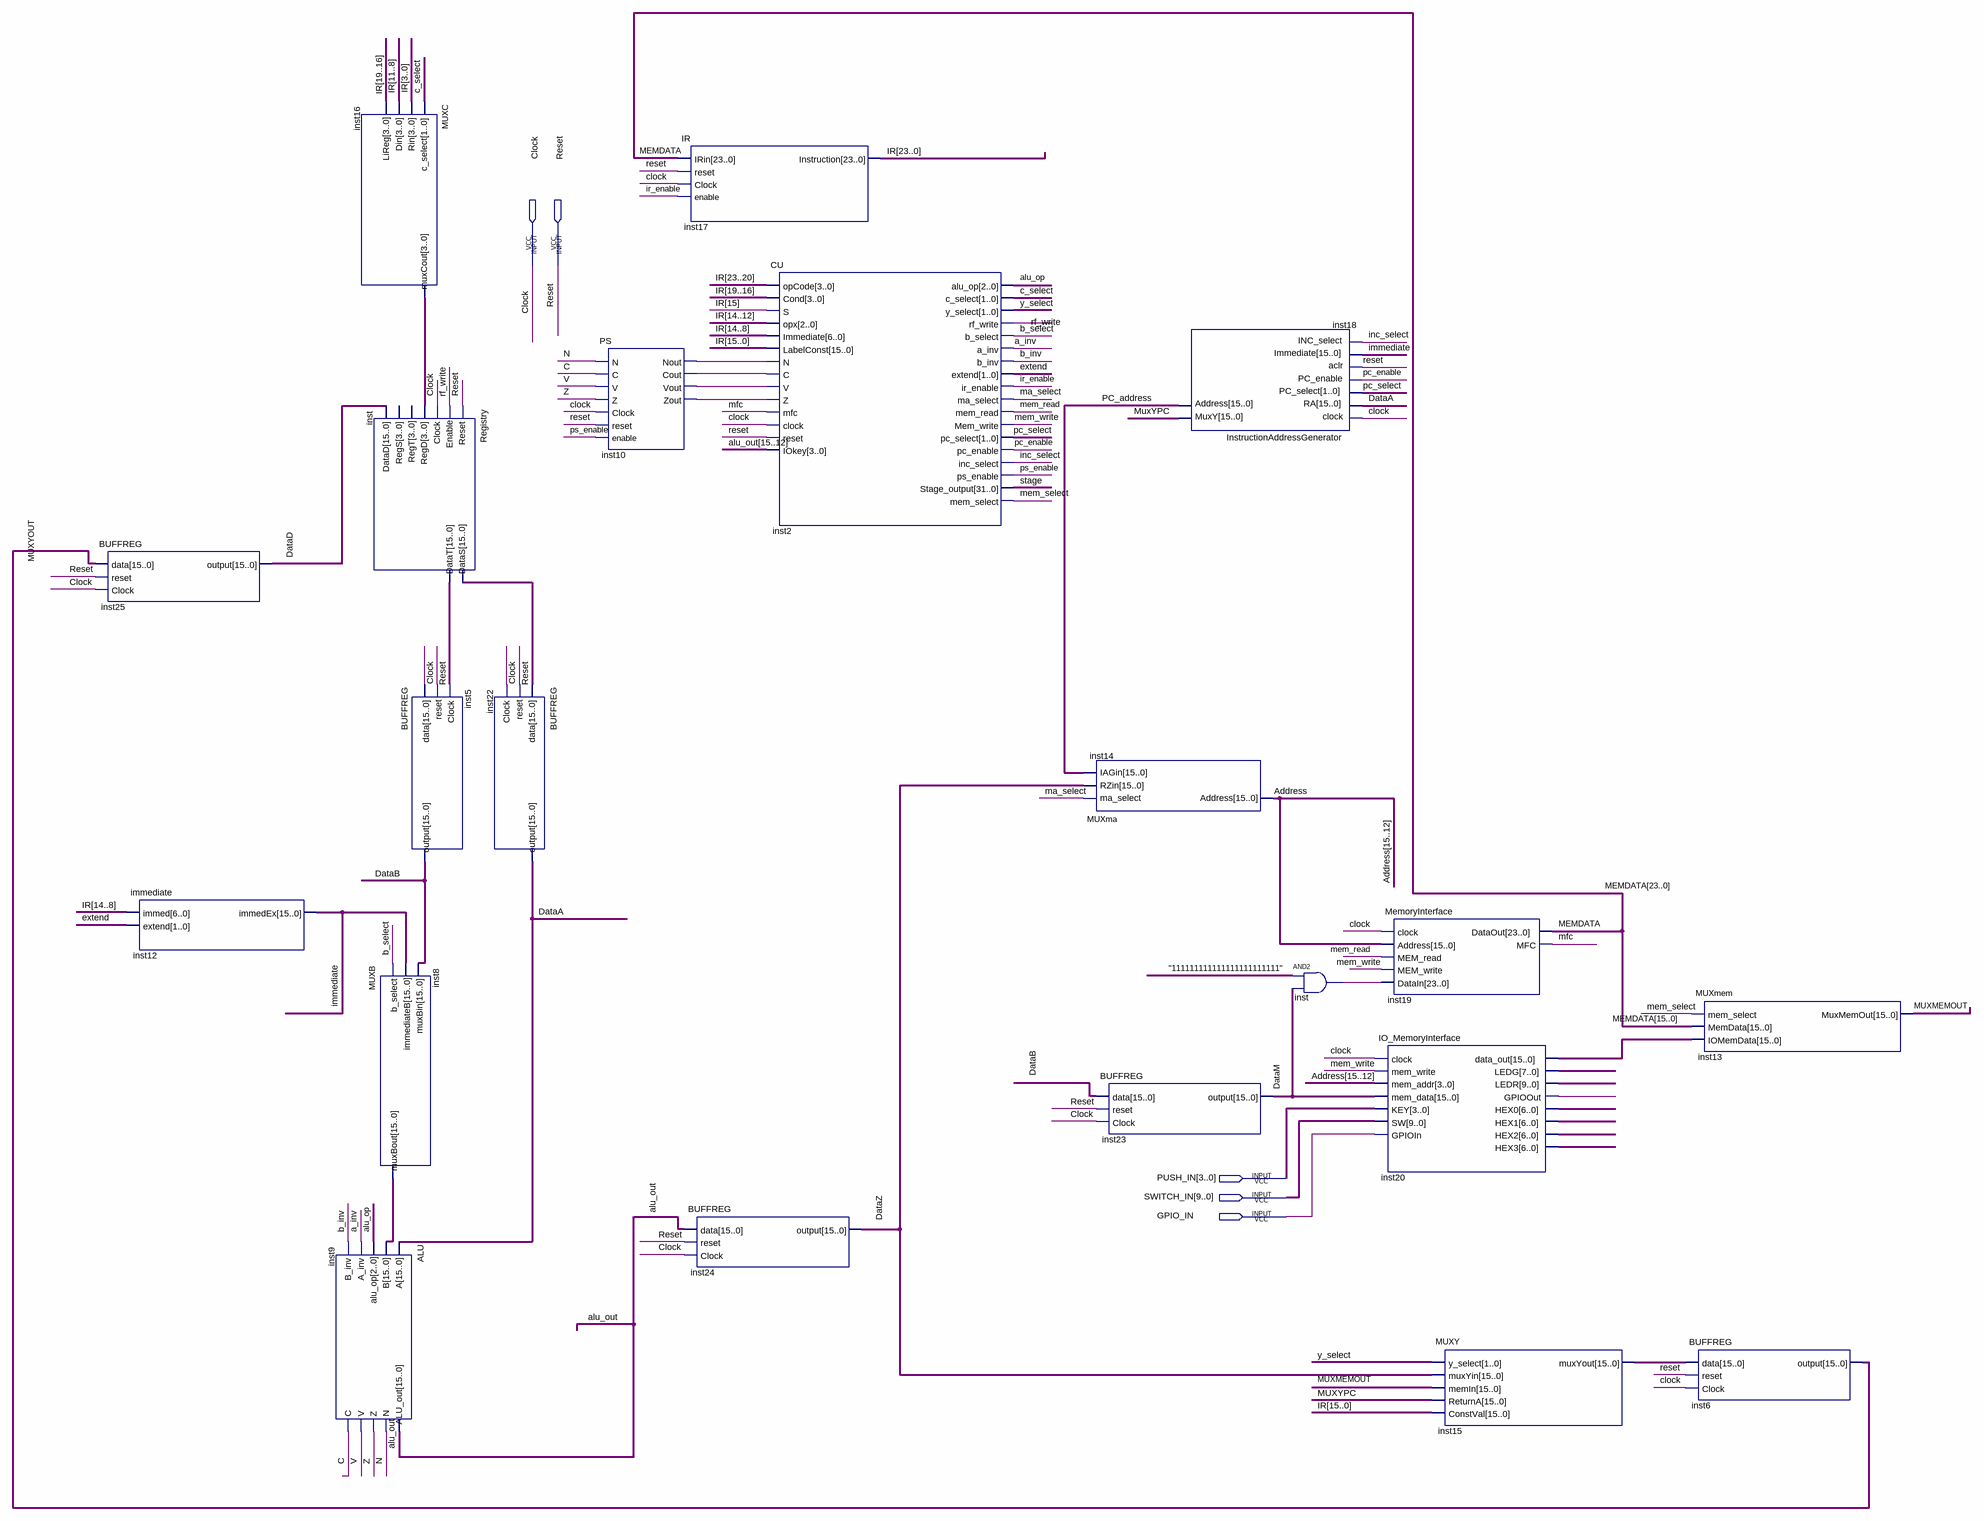
[diagram p0: schematic sheet]
// Quartus schematic FullProcessor.bdf as structural Verilog: 21 symbols, 5 pins
module FullProcessor (
  input  Clock,
  input  Reset,
  input  [3:0] PUSH_IN,
  input  [9:0] SWITCH_IN,
  input  GPIO_IN
);

  wire \"111111111111111111111111" , a_inv, Address_1bit, alu_op, alu_out_1bit, b_inv, b_select, C, c_select,
       DataA, DataB, DataD, DataM, DataZ, extend, immediate, inc_select, inst10_cout, inst10_nout,
       inst10_vout, inst10_zout, inst20_gpioout, inst_out, ir_enable, ma_select, mem_read, mem_select,
       mem_write, MEMDATA_1bit, mfc, MUXMEMOUT, MUXYOUT, MuxYPC, N, PC_address, pc_enable, pc_select,
       ps_enable, rf_write, stage, V, y_select, Z;
  wire [3:0] inst16_muxcout;
  wire [6:0] inst20_hex0, inst20_hex1, inst20_hex2, inst20_hex3;
  wire [7:0] inst20_ledg;
  wire [9:0] inst20_ledr;
  wire [15:0] inst8_muxbout, inst15_muxyout, inst20_data_out, inst_datas, inst_datat, MEMDATA;
  wire [15:12] Address, alu_out;
  wire [23:0] IR;

  BUFFREG inst25 (.data({16{MUXYOUT}}), .reset(Reset), .Clock(Clock), .\output (DataD));
  immediate inst12 (.immed(IR[14:8]), .extend({2{extend}}), .immedEx(immediate));
  ALU inst9 (
    .A({16{DataA}}), .B(inst8_muxbout), .alu_op({3{alu_op}}), .A_inv(a_inv), .B_inv(b_inv),
    .ALU_out(alu_out_1bit), .N(N), .Z(Z), .V(V), .C(C));
  MUXC inst16 (.c_select({2{c_select}}), .Rin(IR[3:0]), .Din(IR[11:8]), .LiReg(IR[19:16]), .muxCout(inst16_muxcout));
  Registry inst (
    .Reset(Reset), .Enable(rf_write), .Clock(Clock), .RegD(inst16_muxcout), .DataD({16{DataD}}),
    .DataS(inst_datas), .DataT(inst_datat));  // open: RegT, RegS
  MUXB inst8 (.b_select(b_select), .immediateB({16{immediate}}), .muxBin({16{DataB}}), .muxBout(inst8_muxbout));
  BUFFREG inst5 (.data({16{Clock}}), .reset(Reset), .Clock(inst_datat), .\output (DataB));
  BUFFREG inst22 (.data(inst_datas), .reset(Reset), .Clock(Clock), .\output (DataA));
  PS inst10 (
    .N(N), .C(C), .V(V), .Z(Z), .Clock(Clock), .reset(Reset), .enable(ps_enable), .Nout(inst10_nout),
    .Cout(inst10_cout), .Vout(inst10_vout), .Zout(inst10_zout));
  IR inst17 (.IRin({24{MEMDATA_1bit}}), .reset(Reset), .Clock(Clock), .enable(ir_enable), .Instruction(IR));
  BUFFREG inst24 (.data({16{alu_out_1bit}}), .reset(Reset), .Clock(Clock), .\output (DataZ));
  CU inst2 (
    .opCode(IR[23:20]), .Cond(IR[19:16]), .S(IR[15]), .opx(IR[14:12]), .Immediate(IR[14:8]),
    .LabelConst(IR[15:0]), .N(inst10_nout), .C(inst10_cout), .V(inst10_vout), .Z(inst10_zout), .mfc(mfc),
    .clock(Clock), .reset(Reset), .IOkey(alu_out), .alu_op(alu_op), .c_select(c_select), .y_select(y_select),
    .rf_write(rf_write), .b_select(b_select), .a_inv(a_inv), .b_inv(b_inv), .extend(extend),
    .ir_enable(ir_enable), .ma_select(ma_select), .mem_read(mem_read), .Mem_write(mem_write),
    .pc_select(pc_select), .pc_enable(pc_enable), .inc_select(inc_select), .ps_enable(ps_enable),
    .Stage_output(stage), .mem_select(mem_select));
  MUXma inst14 (.ma_select(ma_select), .RZin({16{DataZ}}), .IAGin({16{PC_address}}), .Address(Address_1bit));
  BUFFREG inst23 (.data({16{DataB}}), .reset(Reset), .Clock(Clock), .\output (DataM));
  InstructionAddressGenerator inst18 (
    .clock(Clock), .RA({16{DataA}}), .PC_select({2{pc_select}}), .PC_enable(pc_enable), .aclr(Reset),
    .Immediate({16{immediate}}), .INC_select(inc_select), .MuxY(MuxYPC), .Address(PC_address));
  and inst_dup2 (inst_out, \"111111111111111111111111" , DataM);
  MemoryInterface inst19 (
    .clock(Clock), .Address({16{Address_1bit}}), .MEM_read(mem_read), .MEM_write(mem_write),
    .DataIn({24{inst_out}}), .DataOut(MEMDATA_1bit), .MFC(mfc));
  IO_MemoryInterface inst20 (
    .clock(Clock), .mem_write(mem_write), .mem_addr(Address), .mem_data({16{DataM}}), .KEY(PUSH_IN),
    .SW(SWITCH_IN), .GPIOIn(GPIO_IN), .data_out(inst20_data_out), .LEDG(inst20_ledg), .LEDR(inst20_ledr),
    .GPIOOut(inst20_gpioout), .HEX0(inst20_hex0), .HEX1(inst20_hex1), .HEX2(inst20_hex2), .HEX3(inst20_hex3));
  MUXY inst15 (
    .y_select({2{y_select}}), .muxYin({16{DataZ}}), .memIn({16{MUXMEMOUT}}), .ReturnA({16{MuxYPC}}),
    .ConstVal(IR[15:0]), .muxYout(inst15_muxyout));
  MUXmem inst13 (.mem_select(mem_select), .MemData(MEMDATA), .IOMemData(inst20_data_out), .MuxMemOut(MUXMEMOUT));
  BUFFREG inst6 (.data(inst15_muxyout), .reset(Reset), .Clock(Clock), .\output (MUXYOUT));
endmodule
